# Altium project SmartMCU.PrjPcb
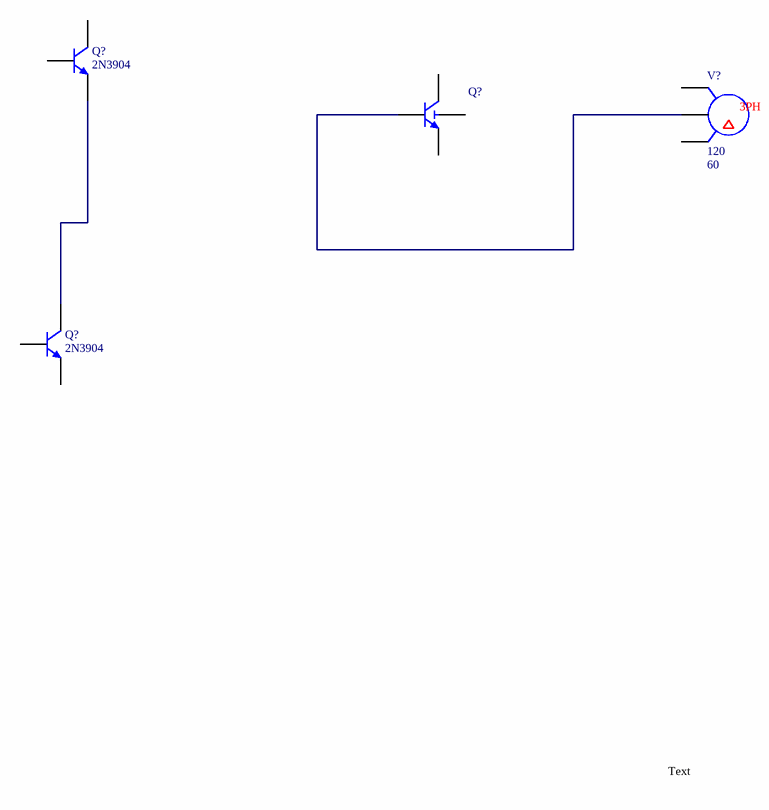
[diagram p0: main.SchDoc]
Designer: Huseyin Sahin; My Title: Smart Mcu Project; Start Date: 02.04.2024
2 sheets, 9 parts. Net scope: global (net labels, ports and power ports of the same name join across sheets).
Sheets:
  main.SchDoc
  Battery.SchDoc

## Sheet main.SchDoc
size A4; Date: 02.04.2024; Author: Hüseyin Şahin; SheetNumber: 1; SheetTotal: 1; SPICEModelCacheRFBQZLPJ: <root> / <DocumentId>RFBQZLPJ</DocumentId> / <CacheFrame Number="0"> / <Model Name="2n3904" Kind="MDL"> / <Text>*2N3904 / *Si 310mW  40V 200mA 300MHz pkg:TO-92B 1,2,3 / .MODEL 2N3904 NPN(IS=1.4E-14 BF=300 VAF=100 IKF=0.025 ISE=3E-13 / + BR=7.5 RC=2.4 CJE=4.5E-12 TF=4E-10 CJC=3.5E-12 TR=2.1E-8 XTB=1.5 KF=9E-16 )</Text> / </Model> / </CacheFrame> / </root>; Time: 16:51

### Parts
(Parts that share a designator on the sheet are numbered #1, #2 ... from top to bottom, then left to right.)
Q?#1  2N3904  [TO-92A]
Q?#2  Bipolar NPN 4 Pins  Transistor Gummel-Poon Model  (value not drawn)
Q?#3  2N3904  [TO-92A]
V?  V_RMS: 120  FREQ: 60  (hidden comment: 3-Phase  Delta Voltage Source)

### Nets
NetQ?#1_1: Q?#1.1(E) Q?#3.3(C)
NetQ?#2_2: Q?#2.2(B) V?.2

Not connected (* = marked no-connect by the designer): Q?#1 2(B) 3(C); Q?#2 1(C) 3(E) 4(S); Q?#3 1(E) 2(B); V? 1 3

### Notes on the sheet
- Text
- (in symbol 3 Phase Delta) 3PH

### Library data of the parts
Q?#1 Q?#3 = 2N3904: NPN General Purpose Amplifier; Published: 8-Jun-2000; LatestRevisionDate: 15-Jan-2003; LatestRevisionNote: PCB Footprint 'BCY-W3/D4.7' replaced; DatasheetVersion: 1997; PackageVersion: Sep-1998; PackageReference: TO-92A; Publisher: Altium Limited; PackageDescription: TO, Flat Index; 3 In-Line, Axial Leads; Body Dia. 4.5mm; Leads 0.51 x 0.48 mm (max); ComponentLink1Description: Manufacturer Link; ComponentLink1URL: http://www.fairchildsemi.com/; ComponentLink2Description: Datasheet; ComponentLink2URL: http://www.fairchildsemi.com/ds/2N%2F2N3904.pdf
Q?#2 = BJT NPN 4 GP: SimulationGenericComponent: True; BF: 100; AF: 0; BR: 1; EG: 1.11; FC: 0.5; IS: 1e-16; MJC: 0.33; NC: 2; NE: 1.5; TNOM: 27; VBC_MAX: 1e99; VJC: 0.75; XTI: 3; CJC: 0; CJE: 0; CJS: 0; CTC: 0; CTE: 0; CTS: 0; IKF: 0; IKR: 0; IRB: 0; ISC: 0; ISE: 0; ISS: 0; ITF: 0; KF: 0; MJE: 0.33; MJS: 0; NF: 1; NKF: 0.5; NR: 1; NS: 1; PTF: 0; RB: 0; RBM: 0; RC: 0; RE: 0; SUBS: 1; TBF1: 0; TBF2: 0; TBR1: 0; TBR2: 0; TF: 0; TIKF1: 0; TIKF2: 0; TIKR1: 0; TIKR2: 0; TIRB1: 0; TIRB2: 0; TIS1: 0; TIS2: 0; TISC1: 0; TISC2: 0; TISE1: 0; TISE2: 0; TITF1: 0; TITF2: 0; TLEV: 0; TLEVC: 0; TMJC1: 0; TMJC2: 0; TMJE1: 0; TMJE2: 0; TMJS1: 0; TMJS2: 0; TNC1: 0; TNC2: 0; TNE1: 0; TNE2: 0; TNF1: 0; TNF2: 0; TNR1: 0; TNR2: 0; TNS1: 0; TNS2: 0; TR: 0; TRB1: 0; TRB2: 0; TRC1: 0; TRC2: 0; TRE1: 0; TRE2: 0; TRM1: 0; TRM2: 0; TTF1: 0; TTF2: 0; TTR1: 0; TTR2: 0; TVAF1: 0; TVAF2: 0; TVAR1: 0; TVAR2: 0; TVJC: 0; TVJE: 0; TVJS: 0; VAF: 0; VAR: 0; VBE_MAX: 1e99; VCE_MAX: 1e99; VJE: 0.75; VJS: 0.75; VTF: 0; XCJC: 1; XTB: 0; XTF: 0
V? = 3 Phase Delta: SimulationGenericComponent: True

## Sheet Battery.SchDoc
size A4; SheetNumber: 2; SheetTotal: 2; SPICEModelCacheDQVFCDDG: <root> / <DocumentId>DQVFCDDG</DocumentId> / <CacheFrame Number="0"> / <Model Name="cap" Kind="MDL"> / <Text>*Default semiconductor capacitor / .MODEL CAP C()</Text> / </Model> / </CacheFrame> / </root>
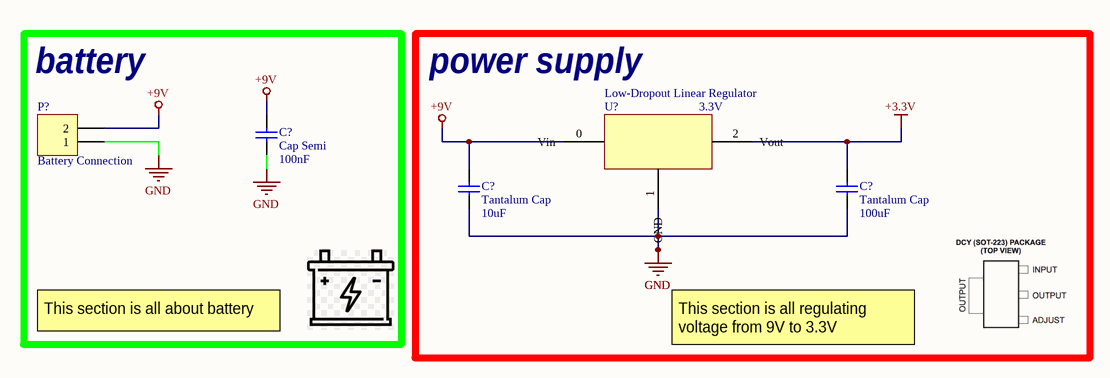
[diagram p1: Battery.SchDoc]

### Parts
(Parts that share a designator on the sheet are numbered #1, #2 ... from top to bottom, then left to right.)
C?#1  Cap Semi  value 100nF  [C1206]
C?#2  Tantalum Cap  value 10uF  [C1206]
C?#3  Tantalum Cap  value 100uF  [C1206]
P?  Battery Connection  [HDR1X2H]
U?  Low-Dropout Linear Regulator  Output Voltage: 3.3V

### Blocks framed on the sheet
battery: C?#1 P?
power supply: C?#2 C?#3 U?

### Nets
+3.3V: C?#3.2
+9V: C?#1.2 C?#2.2 P?.2
GND: C?#1.1 C?#2.1 C?#3.1 P?.1

Not connected (* = marked no-connect by the designer): U? 0(Vin) 1(GND) 2(Vout)

### Notes on the sheet
- This section is all about battery
- This section is all regulating voltage from 9V to 3.3V

### Library data of the parts
C?#1-C?#3 = Cap Semi: Capacitor (Semiconductor SIM Model); Published: 8-Jun-2000; LatestRevisionDate: 29-May-2009; LatestRevisionNote: IPC-7351 Footprint Added.; PackageReference: C1206; Publisher: Altium Limited; PackageDescription: Chip Capacitor
P? = Header 2H: Header, 2-Pin, Right Angle; LatestRevisionDate: 17-Jul-2002; LatestRevisionNote: Re-released for DXP Platform.; Publisher: Altium Limited
U? = lm1117: The LM1117 is a low dropout voltage regulator with a / dropout of 1.2 V at 800 mA of load current. / The LM1117 is available in an adjustable version, / which can set the output voltage from 1.25 V to 13.8 V / with only two external resistors. In addition, the device / is available in five fixed voltages, 1.8 V, 2.5 V, 3.3 V, / and 5 V. / The LM1117 offers current limiting and thermal / shutdown. The circuit includes a Zener trimmed bandgap reference to assure output voltage accuracy to / within ±1%. / A minimum of 10-µF tantalum capacitor is required / at the output to improve the transient response and / stability.; ComponentLink1Description: datasheet; ComponentLink1URL: https://www.ti.com/lit/ds/symlink/lm1117.pdf?ts=1712049006696&ref_url=https%253A%252F%252Fwww.ti.com%252Fproduct%252FLM1117%253Futm_source%253Dgoogle%2526utm_medium%253Dcpc%2526utm_campaign%253Dapp-lp-null-44700045336317554_prodfolderdynamic-cpc-pf-google-eu_int%2526utm_content%253Dprodfolddynamic%2526ds_k%253DDYNAMIC+SEARCH+ADS%2526DCM%253Dyes%2526gad_source%253D1%2526gclid%253DCj0KCQjw2a6wBhCVARIsABPeH1uYEq1Svy05QXeal8vxv4gDdpf7Kfib-JbV4jIHqkrYcvgrk_cPtXsaAl5sEALw_wcB%2526gclsrc%253Daw.ds